# EAGLE design X10 - Main Board_RevB (EAGLE 9.6.2)
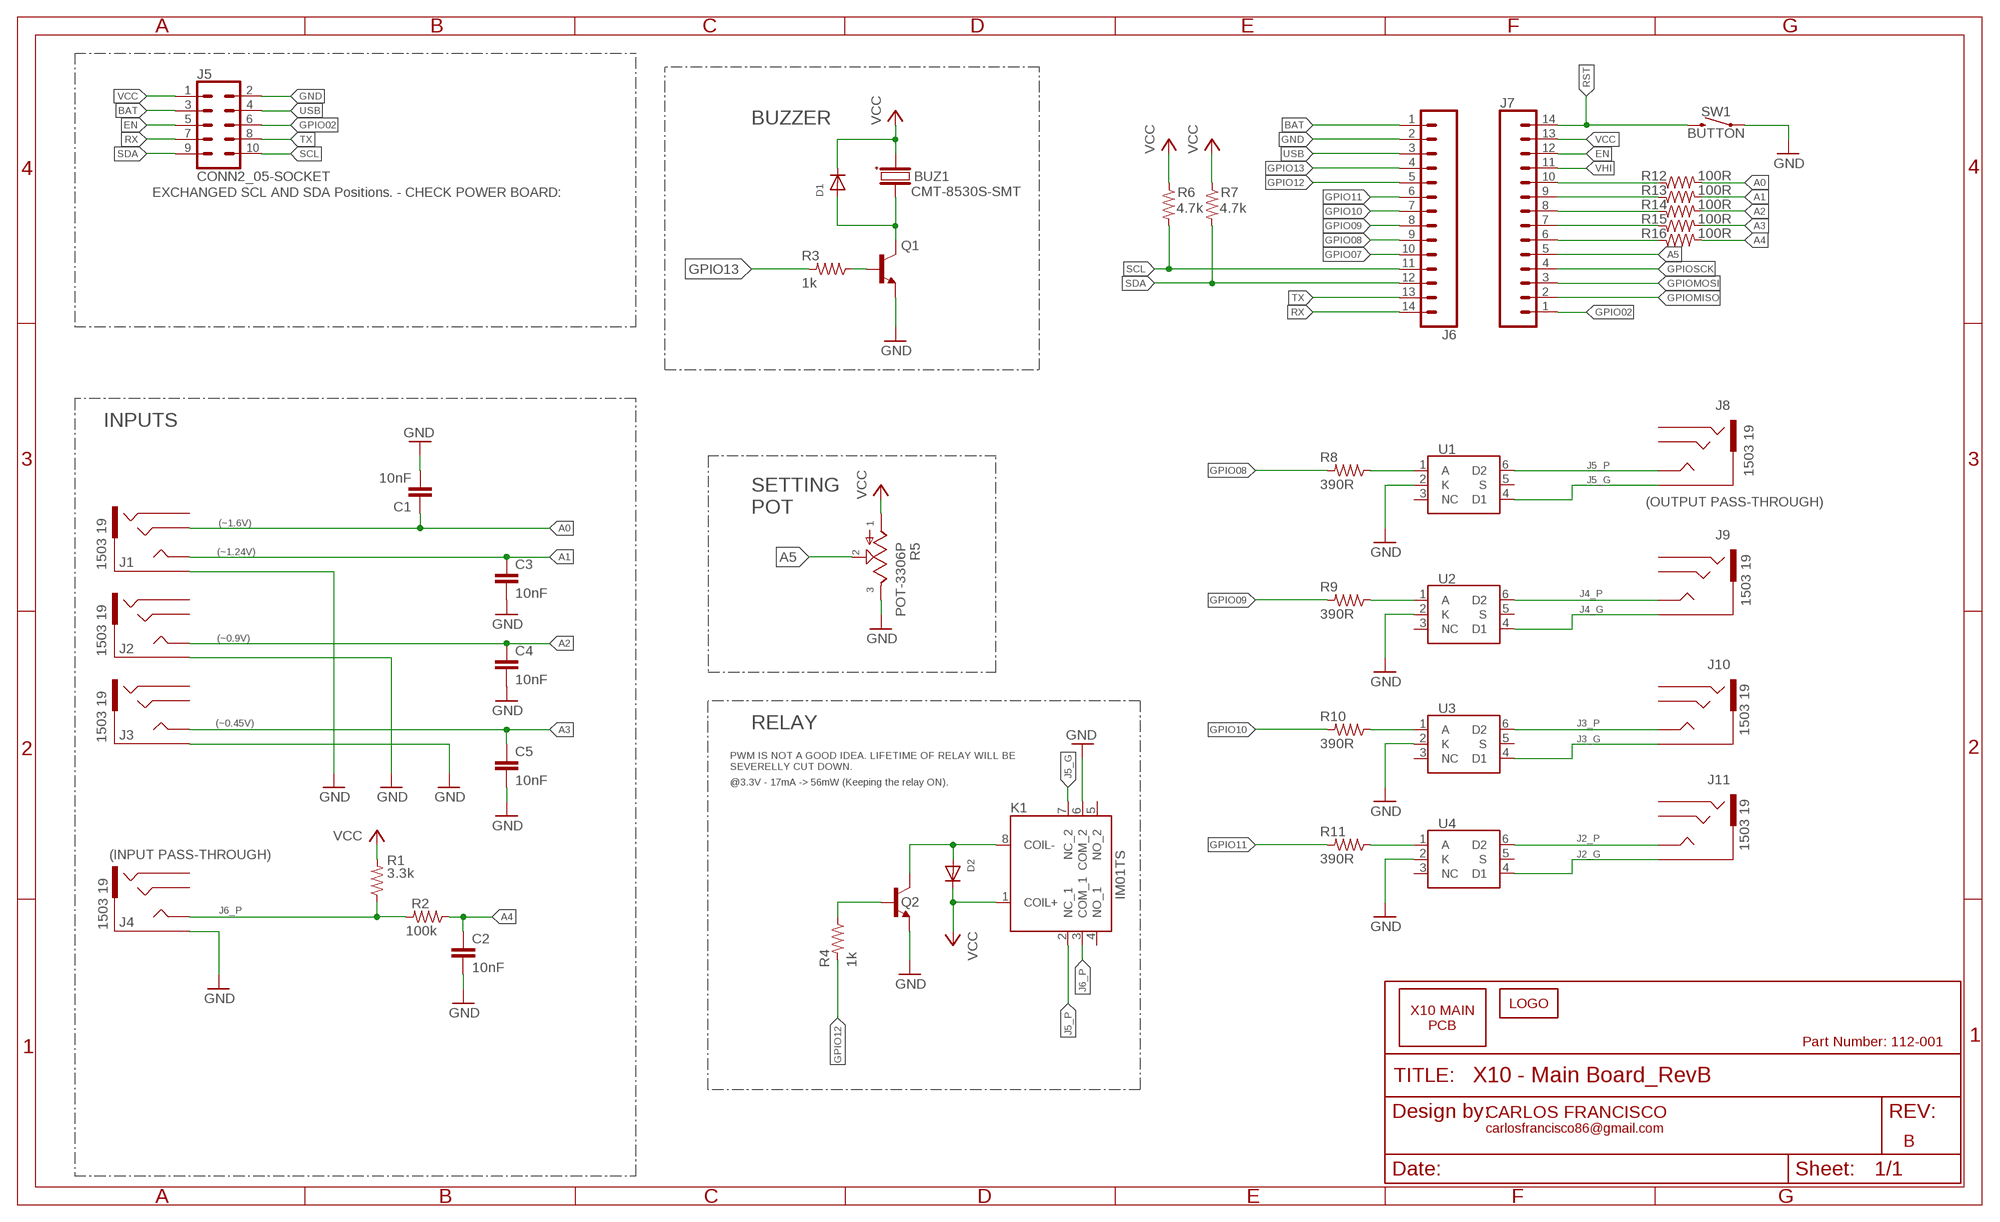
[diagram p0: schematic, sheet 1]

## Parts
BUZ1  CMT-8530S-SMT  BUZZER-CMT-8530S-SMT-TR  [CMT8530SSMTTR]
C1  10nF  C-10NF-50V-X7R-0603  [CAPC1608X85]
C2  10nF  C-10NF-50V-X7R-0603  [CAPC1608X85]
C3  10nF  C-10NF-50V-X7R-0603  [CAPC1608X85]
C4  10nF  C-10NF-50V-X7R-0603  [CAPC1608X85]
C5  10nF  C-10NF-50V-X7R-0603  [CAPC1608X85]
D1  DIODE-SOD-123  [SOD-123]
D2  DIODE-SOD-123  [SOD-123]
J1  1503 19  STEREO_JACK-1503-19  [1503-19]
J2  1503 19  STEREO_JACK-1503-19  [1503-19]
J3  1503 19  STEREO_JACK-1503-19  [1503-19]
J4  1503 19  STEREO_JACK-1503-19  [1503-19]
J5  CONN2_05-SOCKET  [2X5_SOCKET]
J6  CONN_14  [1X14]
J7  CONN_14  [1X14]
J8  1503 19  STEREO_JACK-1503-19  [1503-19]
J9  1503 19  STEREO_JACK-1503-19  [1503-19]
J10  1503 19  STEREO_JACK-1503-19  [1503-19]
J11  1503 19  STEREO_JACK-1503-19  [1503-19]
K1  IM01TS  IM02TS  [IM03TS114620378]
LOGO1  LOGO-10MM  [LOGO_10MM]
PCB1  X10_MAIN_PCB-X10_MAIN  [X10_MAIN_PCB]
Q1  NPN-SOT-23  [SOT-23]
Q2  NPN-SOT-23  [SOT-23]
R1  3.3k  R-3.3K-1%-0603  [R0603]
R2  100k  R-100K-1%-0603  [R0603]
R3  1k  R-1K-1%-0603  [R0603]
R4  1k  R-1K-1%-0603  [R0603]
R5  POT-3306P  [3306P1103]
R6  4.7k  R-390R-1%-0603  [R0603]
R7  4.7k  R-390R-1%-0603  [R0603]
R8  390R  R-390R-1%-0603  [R0603]
R9  390R  R-390R-1%-0603  [R0603]
R10  390R  R-390R-1%-0603  [R0603]
R11  390R  R-390R-1%-0603  [R0603]
R12  100R  R-100R-1%-0603  [R0603]
R13  100R  R-100R-1%-0603  [R0603]
R14  100R  R-100R-1%-0603  [R0603]
R15  100R  R-100R-1%-0603  [R0603]
R16  100R  R-100R-1%-0603  [R0603]
SW1  BUTTON  [SERIES95C_RA]
U1  LH1500AT  SSR-LH1500AT  [DIP762W47P254L880H410Q6N]
U2  LH1500AT  SSR-LH1500AT  [DIP762W47P254L880H410Q6N]
U3  LH1500AT  SSR-LH1500AT  [DIP762W47P254L880H410Q6N]
U4  LH1500AT  SSR-LH1500AT  [DIP762W47P254L880H410Q6N]

## Nets
A0: C1.1 J1.3 R12.1
A1: C3.1 J1.4 J1.5 R13.1
A2: C4.1 J2.4 J2.5 R14.1
A3: C5.1 J3.4 J3.5 R15.1
A4: C2.1 R2.2 R16.1
A4_R: J7.6 R16.2
A5: J7.5 R5.2
BAT: J5.3 J6.1
BUZ_CTRL_R: Q1.B R3.2
EN: J5.5 J7.12
GND: C1.2 C2.2 C3.2 C4.2 C5.2 J1.1 J2.1 J3.1 J4.1 J5.2 J6.2 K1.6(COM_2) Q1.E Q2.E R5.3 SW1.T1 U1.2(K) U2.2(K) U3.2(K) U4.2(K)
GPIO02: J5.6 J7.1
GPIO07: J6.10
GPIO08: J6.9 R8.1
GPIO09: J6.8 R9.1
GPIO10: J6.7 R10.1
GPIO11: J6.6 R11.1
GPIO12: J6.5 R4.1
GPIO13: J6.4 R3.1
GPIOMISO: J7.2
GPIOMOSI: J7.3
GPIOSCK: J7.4
J2_G: J11.1 U4.4(D1)
J2_P: J11.4 J11.5 U4.6(D2)
J3_G: J10.1 U3.4(D1)
J3_P: J10.4 J10.5 U3.6(D2)
J4_G: J9.1 U2.4(D1)
J4_P: J9.4 J9.5 U2.6(D2)
J5_G: J8.1 K1.7(NC_2) U1.4(D1)
J5_P: J8.4 J8.5 K1.2(NC_1) U1.6(D2)
J6_P: J4.4 J4.5 K1.3(COM_1) R1.2 R2.1
N$1: BUZ1.3(-) D1.A Q1.C
N$2: J7.10 R12.2
N$3: J7.9 R13.2
N$4: J7.8 R14.2
N$5: J7.7 R15.2
N$6: R8.2 U1.1(A)
N$8: R9.2 U2.1(A)
N$9: R11.2 U4.1(A)
N$10: R10.2 U3.1(A)
N$14: D2.A K1.8(COIL-) Q2.C
N$19: Q2.B R4.2
RST: J7.14 SW1.T2
RX: J5.7 J6.14
SCL: J5.10 J6.11 R6.1
SDA: J5.9 J6.12 R7.1
TX: J5.8 J6.13
USB: J5.4 J6.3
VCC: BUZ1.2(+) D1.C D2.C J5.1 J7.13 K1.1(COIL+) R1.1 R5.1 R6.2 R7.2
VHI: J7.11
Unconnected: J1.2 J2.2 J2.3 J3.2 J3.3 J4.2 J4.3 J8.2 J8.3 J9.2 J9.3 J10.2 J10.3 J11.2 J11.3 K1.4(NO_1) K1.5(NO_2) U1.3(NC) U1.5(S) U2.3(NC) U2.5(S) U3.3(NC) U3.5(S) U4.3(NC) U4.5(S)

## Notes on the sheet
- BUZZER
- EXCHANGED SCL AND SDA Positions. - CHECK POWER BOARD:
- INPUTS
- (OUTPUT PASS-THROUGH)
- SETTING
  POT
- (~1.6V)
- (~1.24V)
- (~0.9V)
- (~0.45V)
- RELAY
- PWM IS NOT A GOOD IDEA. LIFETIME OF RELAY WILL BE
  SEVERELLY CUT DOWN.
- @3.3V - 17mA -> 56mW (Keeping the relay ON).
- (INPUT PASS-THROUGH)
- Part Number: 112-001
- CARLOS FRANCISCO
- carlosfrancisco86@gmail.com
- B

## Library data of the parts
BUZ1 = RubenMiessen:BUZZER: Electromagnetic transducer buzzer
C1-C5 = AceCenter:C; DESCRIPTION: CAP CER 10NF 50V X7R 0603; MFR: Samsung; MFR_NUM: CL10B103KB8WPJC; VENDOR: Digi-Key; VENDOR_NUM: 1276-CL10B103KB8WPJCCT-ND
D1 D2 = AceCenter:DIODE: General purpose diode
J1-J4 J8-J11 = AceCenter:STEREO_JACK: 3.5 mm PCB Mount Stereo Jack Socket; DESCRIPTION: Lumberg 3.5 mm PCB Mount Stereo Jack Socket, 4Pole 1A; MFR: Lumberg; MFR_NUM: 1503 19; VENDOR: RS-ONLINE; VENDOR_NUM: 124-8885
J5 = AceCenter:CONN2_05
J6 J7 = SparkFun-Connectors:CONN_14: Multi connection point. Often used as Generic Header-pin footprint for 0.1 inch spaced/style header connections On any of the 0.1 inch spaced packages, you can populate with these: Break Away Headers - Straight <https://www.sparkfun.com/products/116> (PRT-00116) Break Away Male Headers - Right Angle <https://www.sparkfun.com/products/553> (PRT-00553) Female Headers <https://www.sparkfun.com/products/115> (PRT-00115) Break Away Headers - Machine Pin <https://www.sparkfun.com/products/117> (PRT-00117) Break Away Female Headers - Swiss Machine Pin <https://www.sparkfun.com/products/743> (PRT-00743) For SCREWTERMINALS and SPRING TERMINALS visit here: Screw Terimnals on SparkFun.com <https://www.sparkfun.com/search/results?term=Screw+Terminals> (5mm/3.5mm/2.54mm spacing) This device is also useful as a general connection point to wire up your design to another part of your project. Our various solder wires solder well into these plated through hole pads. Hook-Up Wire - Assortment (Stranded, 22 AWG) <https://www.sparkfun.com/products/11375> (PRT-11375) Hook-Up Wire - Assortment (Solid Core, 22 AWG) <https://www.sparkfun.com/products/11367> (PRT-11367) View the entire wire category on our website here <https://www.sparkfun.com/categories/141> Special notes: Molex polarized connector foot print use with SKU : PRT-08231 with associated crimp pins and housings. 1MM SMD Version SKU: PRT-10208 NOTES ON THE VARIANTS LOCK and LOCK_LONGPADS... This footprint was designed to help hold the alignment of a through-hole component (i.e. 6-pin header) while soldering it into place. You may notice that each hole has been shifted either up or down by 0.005 of an inch from it's more standard position (which is a perfectly straight line). This slight alteration caused the pins (the squares in the middle) to touch the edges of the holes. Because they are alternating, it causes a "brace" to hold the component in place. 0.005 has proven to be the perfect amount of "off-center" position when using our standard breakaway headers. Although looks a little odd when you look at the bare footprint, once you have a header in there, the alteration is very hard to notice. Also,if you push a header all the way into place, it is covered up entirely on the bottom side.
K1 = AceCenter:IM02TS: DPDT telecom PCB relay, 2A 5Vdc coil, EA Source: Datasheet <http://uk.rs-online.com/web/p/products/4227029>; DESCRIPTION: DPDT telecom PCB relay, 2A 5Vdc coil, EA; MFR: TE Connectivity; MFR_NUM: IM02TS; VALUE: IM02TS; VENDOR: RS-ONLINE; VENDOR_NUM: 422-7013
LOGO1 = AceCenter:LOGO
PCB1 = AceCenter:X10_MAIN_PCB
Q1 Q2 = AceCenter:NPN
R1 = AceCenter:R: SMD Resistor; DESCRIPTION: RES SMD 3.3K OHM 1% 1/10W 0603; MFR: Yageo; MFR_NUM: RC0603FR-073K3L; VENDOR_NUM: 311-3.30KHRCT-ND
R2 = AceCenter:R: SMD Resistor; DESCRIPTION: RES SMD 100K OHM 1% 1/10W 0603; MFR: Yageo; MFR_NUM: RC0603FR-07100KL; VENDOR_NUM: 311-100KHRCT-ND
R3 R4 = AceCenter:R: SMD Resistor; DESCRIPTION: RES 1K OHM 0.1% 1/10W 0603; MFR: Yageo; MFR_NUM: RC0603FR-071KL; VENDOR_NUM: 311-1.00KHRCT-ND
R5 = AceCenter:POT: Bourns 3386P Series Through Hole Cermet Trimmer Resistor with Solder Pin Terminations, 20 +/-10% 0.5W +/-100ppm/C Source: Datasheet <https://www.bourns.com/docs/Product-Datasheets/3386.pdf>
R6 R7 = AceCenter:R: SMD Resistor; DESCRIPTION: RES SMD 390 OHM 5% 1/10W 0603; MFR: Yageo; MFR_NUM: RC0603JR-07390RL; VALUE: 390R; VENDOR_NUM: 311-390GRCT-ND
R8-R11 = AceCenter:R: SMD Resistor; DESCRIPTION: RES SMD 390 OHM 5% 1/10W 0603; MFR: Yageo; MFR_NUM: RC0603JR-07390RL; VENDOR_NUM: 311-390GRCT-ND
R12-R16 = AceCenter:R: SMD Resistor; DESCRIPTION: RES SMD 100 OHM 1% 1/10W 0603; MFR: Yageo; MFR_NUM: RC0603FR-07100RL; VENDOR_NUM: 311-100RHRCT-ND
SW1 = AceCenter:BUTTON
U1-U4 = AceCenter:SSR: Vishay 1 Form A Solid-State Relay (Normally Open); DESCRIPTION: 1 Form A Solid-State Relay (NO); MFR: Vishay; MFR_NUM: LH1500AT; VENDOR: RS-ONLINE; VENDOR_NUM: 180-8794

## Board
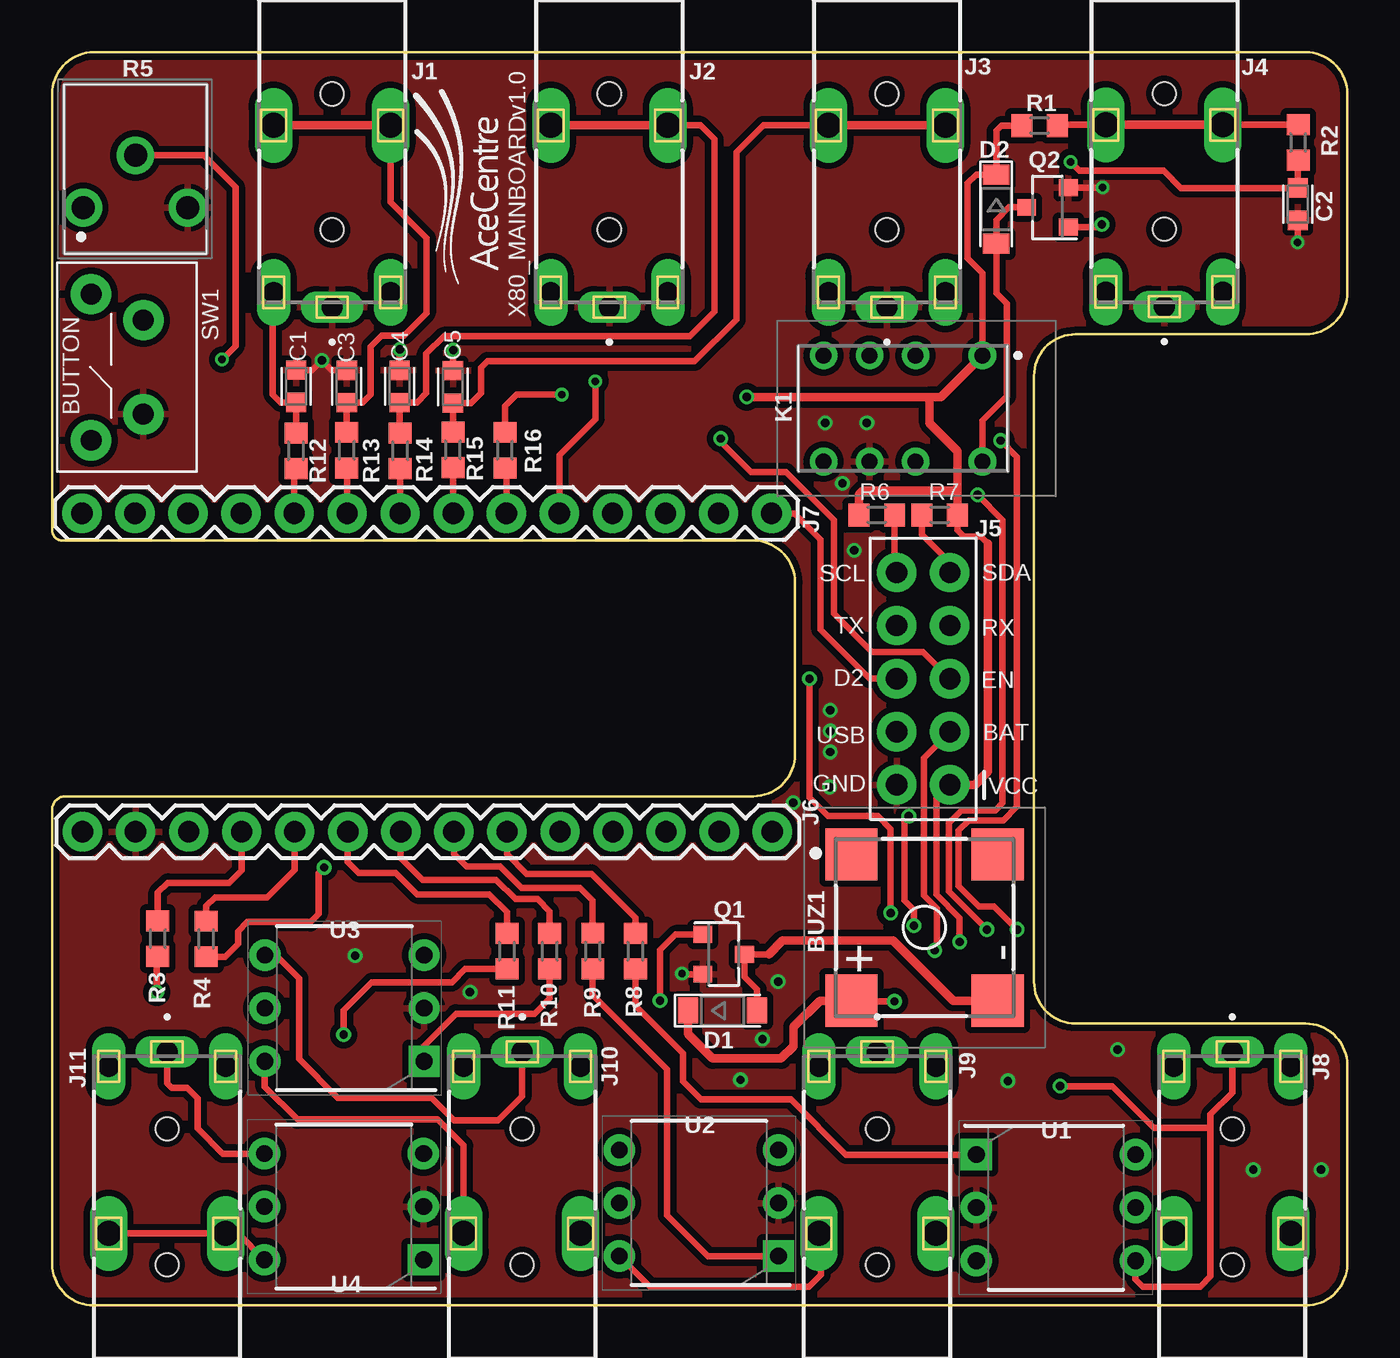
[diagram p1: board, top side]
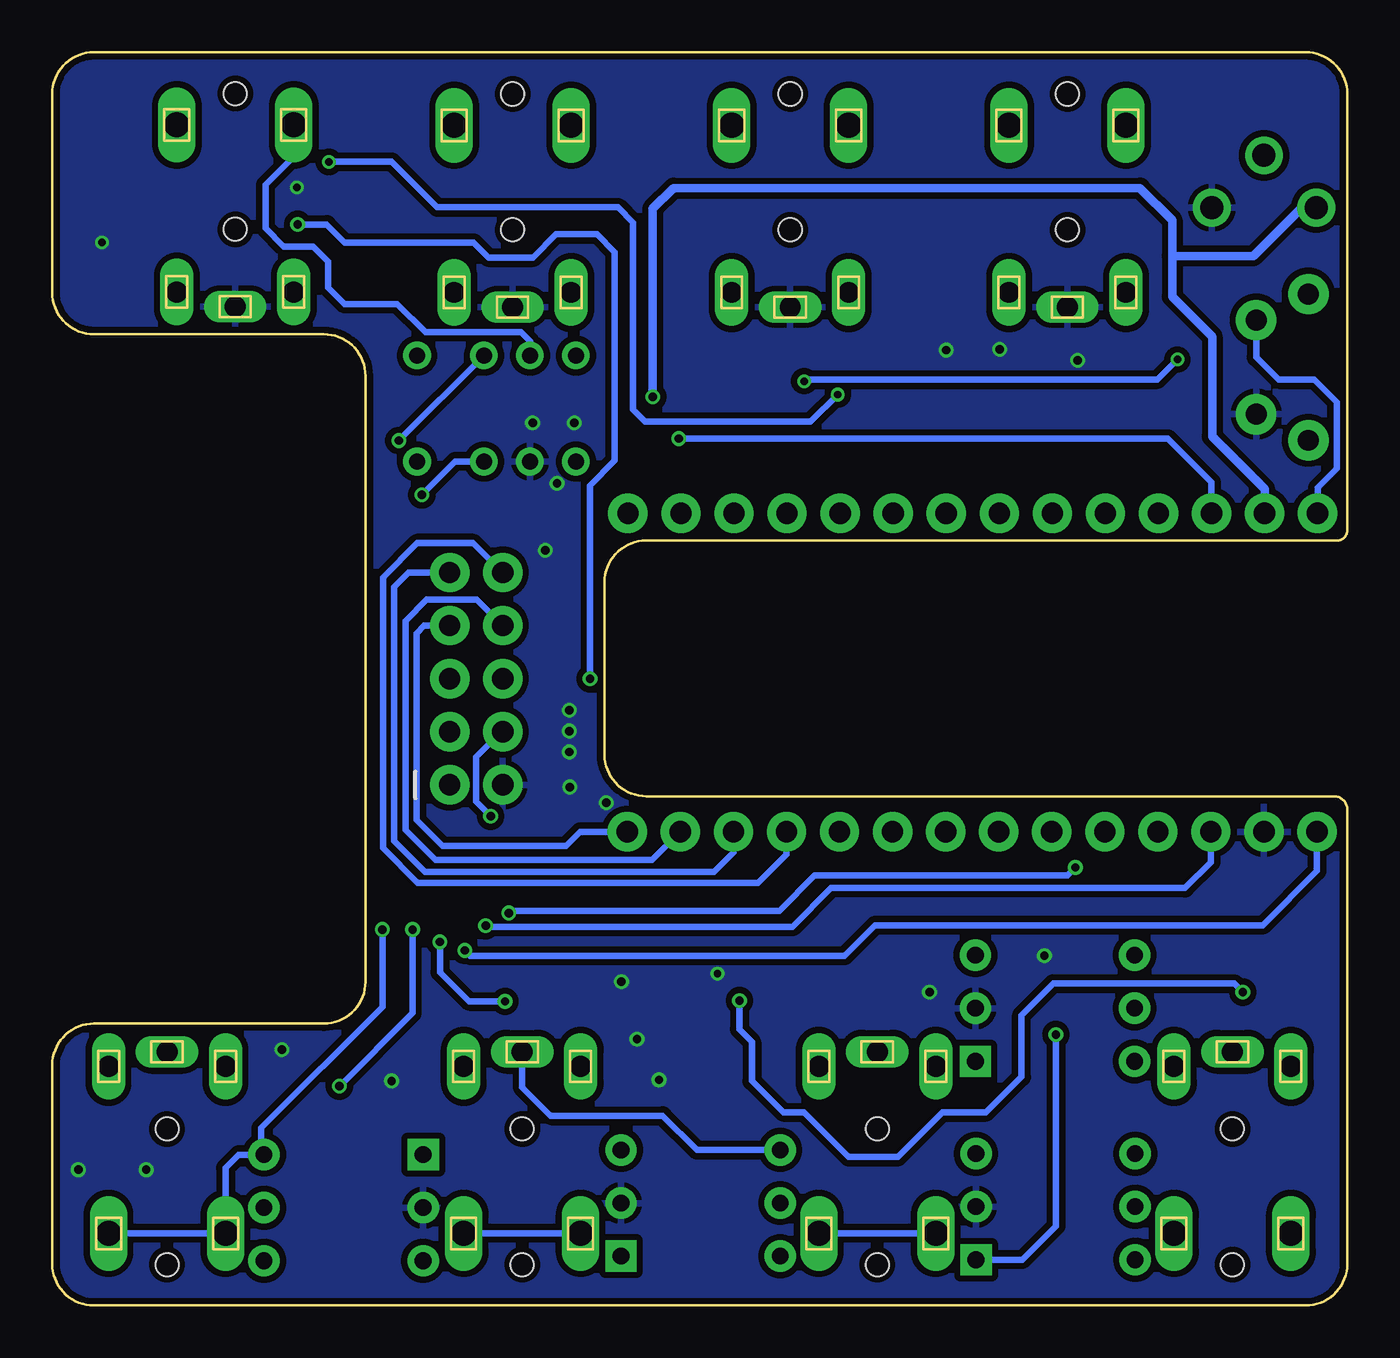
[diagram p2: board, bottom side, seen from below]

Size 62 x 60 mm. Coordinates in mm from the lower left corner, seen from the top.
Copper layers (1*16): Top 0.035mm / dielectric 1.5mm / Bottom 0.035mm
Design rules "SparkFun-2-layer-PCBWay-LIMIT": minimum track width 6mil, minimum drill 0.3mm, track to track 6mil, track to pad 6mil, pad to pad 6mil, via to via 6mil, smd to smd 6mil, copper to edge 6mil, drill to drill 6mil, minimum pad ring 6mil, minimum via ring 6mil, stop-mask expansion 4mil, vias tented up to drill 25mil, thermal gap 10mil

### Footprints (pad centres in the part's own frame; a part is rotated, then mirrored left to right if it is on the bottom)
CMT8530SSMTTR = smd 2.5 x 2.5: 1 -3.5,-3.5; 2 3.5,-3.5; 3 3.5,3.5; 4 -3.5,3.5
CAPC1608X85 = smd 0.921 x 0.97: 1 -0.775,0; 2 0.775,0
SOD-123 = smd 0.95 x 1.25: A 1.65,0; C -1.65,0
1503-19 = drill 1 pad 1.5 long: 1 14.7,0 | drill 1 pad 1.6 long: 2 14,2.8; 3 14,-2.8 | drill 1.2 pad 1.8 long: 4 6,2.8; 5 6,-2.8 | hole 1.1: 4.5,0; 11,0
2X5_SOCKET = drill 1.016 pad 1.88: 1 0,0; 2 0,2.54; 3 2.54,0; 4 2.54,2.54; 5 5.08,0; 6 5.08,2.54; 7 7.62,0; 8 7.62,2.54; 9 10.16,0; 10 10.16,2.54
1X14 = drill 1.016 pad 1.88: 1 0,0; 2 2.54,0; 3 5.08,0; 4 7.62,0; 5 10.16,0; 6 12.7,0; 7 15.24,0; 8 17.78,0; 9 20.32,0; 10 22.86,0; 11 25.4,0; 12 27.94,0; 13 30.48,0; 14 33.02,0
IM03TS114620378 = drill 0.77 pad 1.32: 1 0,0; 2 3.2,0; 3 5.4,0; 4 7.6,0; 5 7.6,5.08; 6 5.4,5.08; 7 3.2,5.08; 8 0,5.08
SOT-23 = smd 0.8 x 0.9: B -0.95,-1; C 0,1; E 0.95,-1
R0603 = smd 1 x 1.1: 1 -0.85,0; 2 0.85,0
3306P1103 = drill 1.1 pad 1.8: 1 -2.5,-2.5; 2 0,0; 3 2.5,-2.5
SERIES95C_RA = drill 1 pad 1.93: F1 3.5,-2.5; F2 -3.5,-2.5; T1 2.25,0; T2 -2.25,0
DIP762W47P254L880H410Q6N = drill 0.8 pad 1.5 square: 1 -3.81,2.54 | drill 0.8 pad 1.5: 2 -3.81,0; 3 -3.81,-2.54; 4 3.81,-2.54; 5 3.81,0; 6 3.81,2.54

### Placement (x,y rotation side)
BUZ1  41.77,18.09 270 top
C1  11.68,44.01 90 top
C2  59.63,52.73 270 top
C3  14.1,44 90 top
C4  16.63,44 90 top
C5  19.18,43.98 90 top
D1  32.09,14.12 0 top
D2  45.19,52.48 270 top
J1  13.4,62.5 270 top
J2  26.67,62.5 270 top
J3  39.96,62.5 270 top
J4  53.24,62.52 270 top
J5  42.97,24.93 90 top
J6  1.45,22.68 0 top
J7  34.44,37.92 180 top
J8  56.5,-2.55 90 top
J9  39.5,-2.55 90 top
J10  22.5,-2.55 90 top
J11  5.5,-2.55 90 top
K1  44.53,45.48 180 top
LOGO1  21.41,48.89 90 top
PCB1  0,0 0 top
Q1  32.15,16.81 270 top
Q2  47.65,52.57 90 top
R1  47.27,56.49 0 top
R2  59.64,55.68 270 top
R3  5.06,17.56 270 top
R4  7.37,17.55 270 top
R5  3.99,55.06 0 top
R6  39.48,37.85 180 top
R7  42.49,37.85 0 top
R8  27.92,16.97 270 top
R9  25.88,16.97 270 top
R10  23.82,16.96 270 top
R11  21.77,16.96 270 top
R12  11.67,40.92 270 top
R13  14.1,40.95 270 top
R14  16.66,40.91 270 top
R15  19.18,40.97 270 top
R16  21.67,40.95 270 top
SW1  4.36,44.92 270 top
U1  48.05,4.68 0 top
U2  30.96,4.9 180 top
U3  13.99,14.23 180 top
U4  13.96,4.73 180 top

### Tracks (layer width: path | path; a pad name or v marks a point on that pad's centre or on a via)
A0
  Top 0.3: R12.1 11.67,43.23 C1.1 10.94,43.23 10.56,43.61 10.56,48.46 J1.3
A1
  Top 0.3: J1.4 16.2,52.83 17.92,51.11 17.92,47.52 16.84,46.44 15.78,46.44 15.25,45.91 15.25,43.61 14.87,43.23 C3.1 R13.1 14.1,43.35
  Top 0.4: J1.5 J1.4
A2
  Top 0.3: J2.4 31.03,56.5 31.7,55.83 31.7,47.57 30.53,46.4 18.75,46.4 17.91,45.56 17.91,43.67 17.46,43.23 C4.1 | R14.1 16.66,41.9 16.63,41.93 C4.1 | C4.1 16.65,43.2
  Top 0.4: J2.5 J2.4
A3
  Top 0.3: 37.37,56.5 34.04,56.5 32.75,55.21 32.75,47.19 30.76,45.2 20.84,45.2 20.53,44.89 20.53,43.69 20.05,43.2 C5.1 R15.1
  Top 0.4: J3.5 37.37,56.5 J3.4
A4  (via drill 0.35)
  Top 0.3: R2.2 59.63,54.81 C2.1 54.03,53.5 53.21,54.32 49.18,54.32 v48.75,54.75 | v24.39,43.61 22.22,43.61 21.67,43.06 R16.1
  Bottom 0.3: v48.75,54.75 45.75,54.75 43.57,52.57 34.92,52.57 34.19,51.84 34.19,42.88 33.62,42.31 25.69,42.31 v24.39,43.61
A4_R
  Top 0.3: J7.6 21.74,40.03 R16.2
A5  (via drill 0.35)
  Top 0.3: J7.5 24.28,40.72 26,42.44 v26,44.25 | v8.13,45.29 8.78,45.94 8.78,53.54 7.26,55.06 R5.2
  Bottom 0.3: v26,44.25 26,44.31 25.98,44.33 9.09,44.33 v8.13,45.29
BAT  (via drill 0.4)
  Top 0.3: J5.3 41.72,26.22 41.72,19.63 42.35,19 42.35,17.1 v42.25,17
  Bottom 0.3: J6.1 1.45,20.8 4.05,18.2 22.61,18.2 24.07,16.74 41.99,16.74 v42.25,17
BUZ_CTRL_R  (via drill 0.4)
  Top 0.3: Q1.B 29.85,17.76 29.1,17.01 v29.1,14.6 | v5,15 5,16.65 R3.2
  Bottom 0.3: v29.1,14.6 29.1,13.22 28.5,12.62 28.5,10.75 27,9.25 26.01,9.25 23.87,7.11 21.52,7.11 19.38,9.25 17.29,9.25 15.6,10.94 15.6,13.89 14.08,15.41 5.41,15.41 v5,15
EN  (via drill 0.4)
  Top 0.3: J5.5 41.69,31.29 39.25,31.29 37.42,33.12 37.42,37.6 35.13,39.89 33.46,39.89 32.14,41.21 32.14,41.45 32.09,41.5 v32,41.5
  Bottom 0.3: J7.12 6.5,39.42 8.58,41.5 v32,41.5
GND  (via drill 0.35, 0.4)
  Top 0.3: Q1.E 30.17,15.86 v30.15,15.88 | Q2.E v50.28,53.52 v50.29,53.53 | C2.2 59.63,50.91 v59.62,50.9 | C1.2 12.45,44.78 v12.91,45.24 13.38,44.77 C3.2 | C4.2 v16.63,45.77 v16.64,45.78 | C5.2 19.18,45.72 v19.2,45.74
  other vias: 37.25,28.5 37.25,27.5 37.25,26.5 20,15 14.5,16.75 45.75,10.75 51,12.25 57.5,6.5 60.75,6.5 37.83,39.36 34.75,15.5 34,12.75 35.47,24.07 37.22,24.82 39,42.25 37,42.25 38.4,36.15 32.95,10.8
  pour Bottom (isolate 0.3): -1,58 -1,0 62,0 62,57 arc90 58,61 2,61 arc90
  pour Top (isolate 0.3): 62,58 62,0 1,0 arc-90 -1,2 -1,57 arc-90 3,61 59,61 arc-90
GPIO02
  Top 0.3: J5.6 39.13,30.01 36.78,32.36 36.78,36.67 35.53,37.92 J7.1
GPIO08
  Top 0.3: J6.9 21.77,21.61 22.71,20.67 25.81,20.67 27.92,18.56 R8.1
GPIO09
  Top 0.3: J6.8 19.23,21.62 19.83,21.02 21.44,21.02 22.48,19.98 25.28,19.98 25.88,19.38 R9.1
GPIO10
  Top 0.3: J6.7 16.69,21.43 17.74,20.38 21.25,20.38 22.18,19.45 23.23,19.45 23.82,18.86 R10.1
GPIO11
  Top 0.3: J6.6 14.15,21.23 14.66,20.72 16.44,20.72 17.47,19.69 20.92,19.69 21.77,18.84 R11.1
GPIO12
  Top 0.3: R4.1 7.37,19.12 7.79,19.54 10.3,19.54 11.61,20.85 J6.5
GPIO13
  Top 0.3: R3.1 5.06,19.77 5.53,20.24 8.47,20.24 9.07,20.84 J6.4
J2_G
  Top 0.3: U4.4 8.17,7.27 6.97,8.47 6.97,9.92 6.46,10.43 5.71,10.43 5.5,10.64 J11.1
J2_P
  Top 0.3: J11.4 J11.5 8.89,3.45 U4.6
J3_G
  Top 0.3: J10.1 22.5,10.02 21.35,8.87 19.24,8.87 18.16,9.95 13.67,9.95 11.81,11.81 11.81,15.67 10.71,16.77 U3.4
J3_P
  Top 0.3: J10.4 19.7,7.66 18.45,8.91 11.74,8.91 10.18,10.47 U3.6
  Bottom 0.3: J10.4 J10.5
J4_G
  Bottom 0.3: J9.1 39.5,10.45 38.14,9.09 32.78,9.09 31.13,7.44 U2.4
J4_P
  Top 0.3: U2.6 28.62,0.89 36.24,0.89 36.81,1.46 36.81,3.34 J9.4
  Bottom 0.3: J9.4 J9.5
J5_G  (via drill 0.4)
  Top 0.3: U1.4 51.86,1.25 52.21,0.9 54.96,0.9 55.45,1.39 55.45,8.5 | J8.1 56.5,10.19 55.45,9.14 55.45,8.5 | v48.25,10.5 50.75,10.5 52.75,8.5 55.45,8.5 | v44.3,38.8 45.5,37.61 45.5,24.05 45.16,23.7 43.53,23.7 42.94,23.11 42.94,19.81 v44.75,18
  Bottom 0.3: K1.7 42.71,40.4 v44.3,38.8 | v48.25,10.5 44.75,14 v44.75,18
J5_P  (via drill 0.4)
  Top 0.3: v45.41,41.41 46.19,40.62 46.19,23.88 45.54,23.23 43.88,23.23 43.39,22.74 43.39,20.08 44.37,19.1 45.09,19.1 v46.19,18
  Bottom 0.3: J8.5 J8.4 53.7,6.59 53.07,7.22 52,7.22 | U1.6 52,7.22 | 52,7.22 52,8.5 46.19,14.31 v46.19,18 | K1.2 v45.41,41.41
J6_P
  Top 0.3: J4.5 48.15,56.52 R1.2 | R2.1 J4.4
  Top 0.4: J4.5 J4.4
  Bottom 0.3: K1.3 39.13,46.17 39.55,46.59 44.12,46.59 45.48,47.95 48.01,47.95 48.79,48.73 48.79,49.97 49.52,50.7 50.91,50.7 51.79,51.58 51.79,53.65 50.44,55 J4.5
N$1
  Top 0.3: D1.A 33.74,15.14 33.15,15.74 Q1.C 34.31,16.81
  Top 0.4: BUZ1.3 43.13,14.6 40.26,17.47 34.97,17.47 34.31,16.81
N$2
  Top 0.3: R12.2 11.58,39.98 J7.10
N$3
  Top 0.3: J7.9 14.12,40.08 R13.2
N$4
  Top 0.3: J7.8 R14.2
N$5
  Top 0.3: J7.7 19.2,40.1 R15.2
N$6
  Top 0.3: U1.1 38.01,7.22 35.36,9.87 31.05,9.87 30.19,10.73 30.19,12.07 27.92,14.34 R8.2
N$8
  Top 0.3: R9.2 25.88,14.87 29.44,11.31 29.44,4.31 31.39,2.36 U2.1
N$9  (via drill 0.4)
  Top 0.3: R11.2 19.77,16.11 19.14,15.48 15.3,15.48 13.95,14.13 v13.95,12.97
  Bottom 0.3: v13.95,12.97 13.95,3.8 15.56,2.19 U4.1
N$10
  Top 0.3: U3.1 17.8,12.44 19.33,13.97 23.08,13.97 23.82,14.71 R10.2
N$14
  Top 0.3: Q2.C 45.8,52.57 45.19,51.96 D2.A 45.19,48.47 45.7,47.96 45.7,43.53 44.53,42.36 K1.8
N$19  (via drill 0.4)
  Top 0.3: R4.2 8.29,16.7 8.89,17.3 8.89,17.91 9.34,18.36 12.36,18.36 12.75,18.75 12.75,20.7 v13.02,20.97 | Q2.B 50.12,51.62 v50.25,51.75 | v40.14,18.79 40.14,22.82 39.53,23.43 37.14,23.43 36.25,24.32 v36.25,30
  Bottom 0.3: v50.25,51.75 48.86,51.75 47.99,50.88 41.82,50.88 41.11,50.17 38.98,50.17 37.87,51.28 35.91,51.28 35.07,50.44 35.07,40.44 36.25,39.26 v36.25,30 | v40.14,18.79 40.03,18.9 27.19,18.9 25.5,20.59 13.4,20.59 v13.02,20.97
RST
  Bottom 0.3: J7.14 1.42,39.15 0.5,40.07 0.5,43.25 1.58,44.33 3.29,44.33 4.36,45.4 SW1.T2
RX
  Bottom 0.3: J6.14 36.73,22.68 37.41,22 43.31,22 44.56,23.25 44.56,32.18 44.19,32.55 J5.7
SCL
  Top 0.3: R6.1 40.33,35.19 J5.10
  Bottom 0.3: J5.10 41.84,36.5 44.52,36.5 46.17,34.85 46.17,21.89 44.5,20.23 28.21,20.23 26.85,21.59 J6.11
SDA
  Top 0.3: R7.1 41.64,36.91 42.97,35.58 J5.9
  Bottom 0.3: J6.12 29.39,21.69 30.32,20.76 44.15,20.76 45.63,22.25 45.63,34.41 44.95,35.09 J5.9
TX
  Bottom 0.3: J5.8 41.67,33.79 44.07,33.79 45.08,32.78 45.08,22.77 43.64,21.32 33.28,21.32 J6.13
USB  (via drill 0.4)
  Top 0.3: v41.25,18.18 41.25,18.95 40.8,19.4 40.8,23.22 v41.01,23.43
  Bottom 0.3: J6.3 6.53,21.22 7.77,19.98 24.71,19.98 26.55,18.14 41.2,18.14 v41.25,18.18 | v41.01,23.43 41.72,24.14 41.72,26.25 40.5,27.47 J5.4
VCC  (via drill 0.4)
  Top 0.3: R1.1 45.44,56.49 45.19,56.24 D2.C 44.23,54.13 43.82,53.72 43.82,50.14 44.53,49.43 K1.1 | J5.1 42.32,24.28 42.32,19.67 43.44,18.55 v43.44,17.41 | v40.32,14.56 38.3,14.56 BUZ1.2 | 44.8,36.47 44.45,36.82 43.65,36.82 43.34,37.13 R7.2
  Top 0.4: v33.25,43.5 42,43.5 | 42,43.5 42.55,43.5 K1.1 | J5.1 44.17,24.93 44.8,25.56 44.8,36.47 | 42,43.5 42,42.25 43.34,40.91 43.34,39 | BUZ1.2 36.74,14.6 35.49,13.34 35.49,12.41 34.9,11.82 31.62,11.82 30.45,12.99 D1.C | R7.2 43.34,39 | R6.2 38.63,38.83 38.82,39.02 43.32,39.02 43.34,39
  Bottom 0.3: v43.44,17.41 43.44,15.95 42.05,14.56 v40.32,14.56
  Bottom 0.4: v33.25,43.5 33.25,52.5 32.25,53.5 9.93,53.5 8.38,51.95 8.38,50.24 | J7.13 3.96,39.09 6.47,41.6 6.47,46.39 8.38,48.3 8.38,50.24 | R5.1 2.18,52.56 4.5,50.24 8.38,50.24

### Text on the board
tPlace: v1.0 | X80_MAINBOARD | SCL | SDA | TX | RX | D2 | EN | USB | BAT | GND | VCC
tDocu: A4 | A5 | D2 | BAT | GND | USB | D13 | D12 | D11 | D10 | D9 | D8 | D7 | SCL | SDA | TX | RX